# Altium schematic sheet Top.SchDoc
size 431 x 279 mm; Author: Shivam Sharma; SheetNumber: 1; SheetTotal: 4; SheetRevision: 1.0
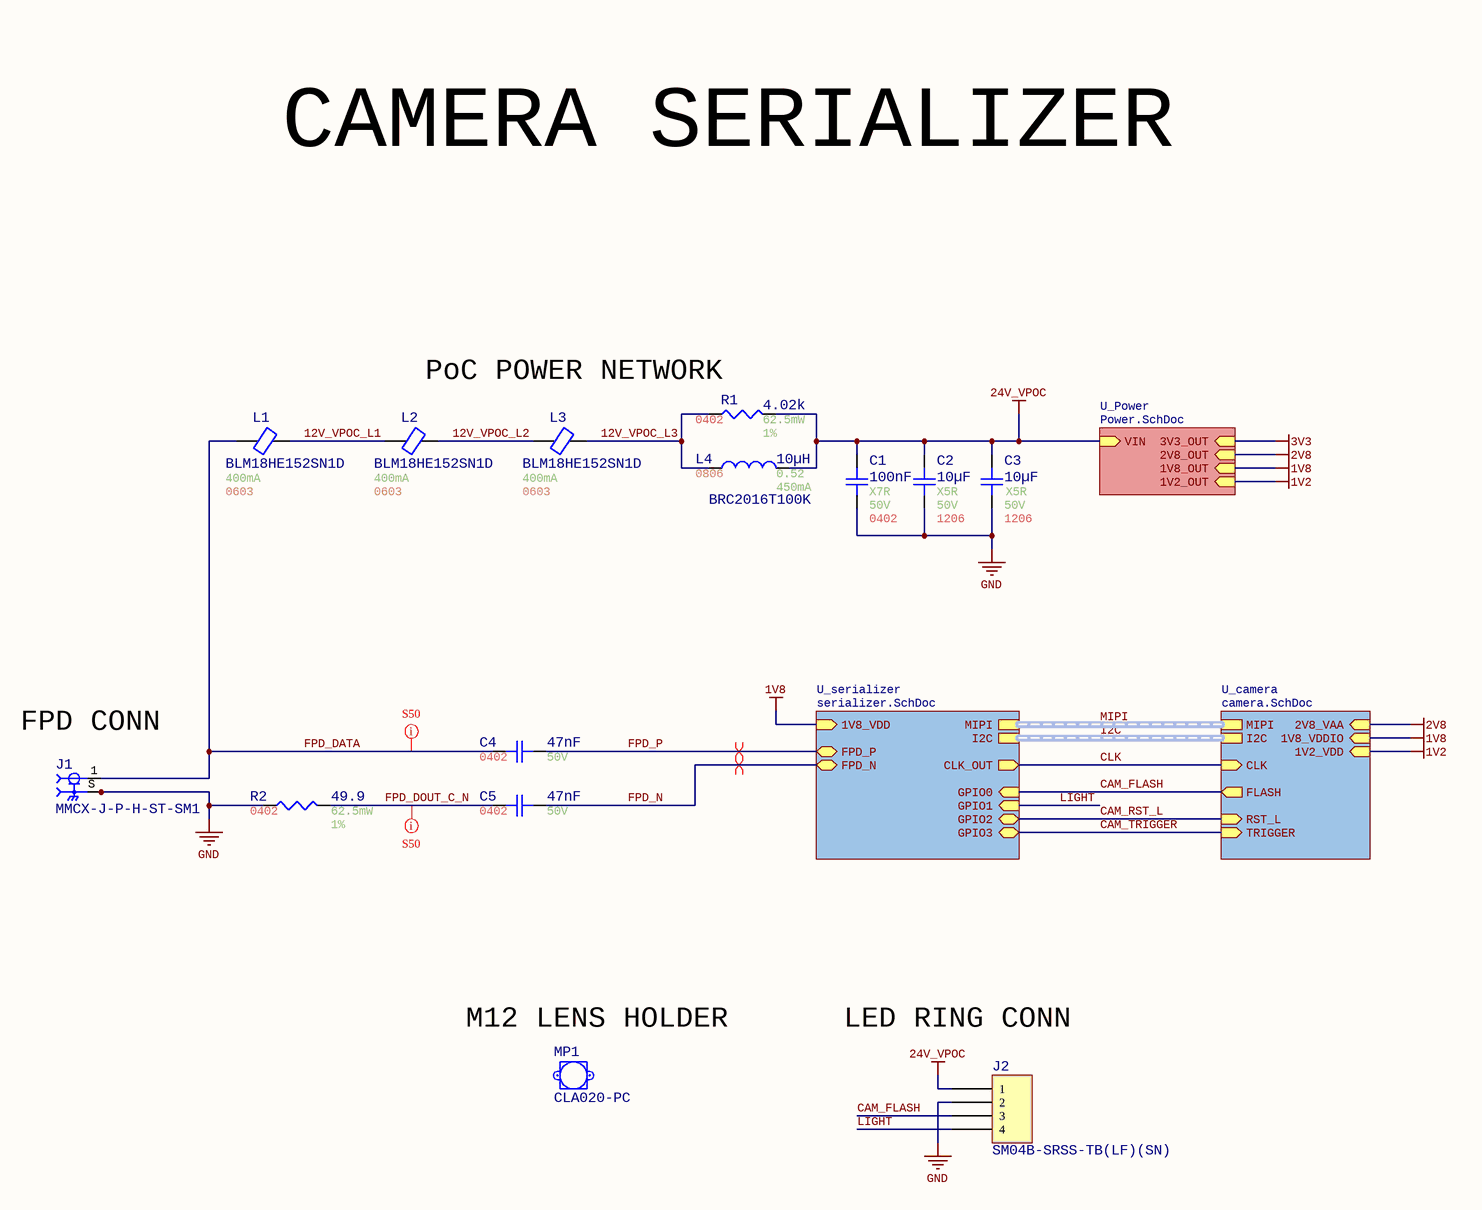
[diagram p0: Top.SchDoc]

## Parts
C1  value 100nF  Temperature Coefficient: X7R  Voltage Rating: 50V  Case/Package: 0402  [Generic 0402 capacitor]  (hidden comment: GRT155R71H104KE01D)
C2  value 10µF  Temperature Coefficient: X5R  Voltage Rating: 50V  Case/Package: 1206  [Generic 1206 Capacitor]  (hidden comment: CL31A106MBHNNNE)
C3  value 10µF  Temperature Coefficient: X5R  Voltage Rating: 50V  Case/Package: 1206  [Generic 1206 Capacitor]  (hidden comment: CL31A106MBHNNNE)
C4  value 47nF  Voltage Rating: 50V  Case/Package: 0402  [Generic 0402 capacitor]  (hidden comment: GRM155R71H473KE14D)
C5  value 47nF  Voltage Rating: 50V  Case/Package: 0402  [Generic 0402 capacitor]  (hidden comment: GRM155R71H473KE14D)
J1  MMCX-J-P-H-ST-SM1  [MMCX-J-P-H-ST-SM1]
J2  SM04B-SRSS-TB(LF)(SN)  [JST SM04B-SRSS-TB]
L1  BLM18HE152SN1D  Current Rating: 400mA  Case/Package: 0603  [0603_1.6x0.8x0.8mm_IND]
L2  BLM18HE152SN1D  Current Rating: 400mA  Case/Package: 0603  [0603_1.6x0.8x0.8mm_IND]
L3  BLM18HE152SN1D  Current Rating: 400mA  Case/Package: 0603  [0603_1.6x0.8x0.8mm_IND]
L4  BRC2016T100K  value 10µH  DCR: 0.52  Current Rating: 450mA  Case/Package: 0806  [0805_2.0x1.6x1.6mm_IND]
MP1  CLA020-PC  [M12_lens_holder_20mm]
R1  value 4.02k  Power: 62.5mW  Tolerance: 1%  Case/Package: 0402  [Generic 0402 Resistor]  (hidden comment: RCA04024K02FKEDSR)
R2  value 49.9  Power: 62.5mW  Tolerance: 1%  Case/Package: 0402  [Generic 0402 Resistor]  (hidden comment: RMCA0402FT49R9-HP)

## Sub-sheets
U_camera = camera.SchDoc: MIPI (harness MIPI), 2V8_VAA (in), 1V8_VDDIO (in), 1V2_VDD (in), I2C (harness I2C), TRIGGER (in), RST_L (in), CLK (in), FLASH (out)
U_Power = Power.SchDoc: VIN (in), 1V2_OUT (in), 3V3_OUT (in), 2V8_OUT (in), 1V8_OUT (in)
U_serializer = serializer.SchDoc: MIPI (harness MIPI), 1V8_VDD (in), FPD_P (bidir), FPD_N (bidir), I2C (harness I2C), GPIO3 (bidir), GPIO2 (bidir), GPIO1 (in), GPIO0 (in), CLK_OUT (out)

## Nets
1V2: sheet U_camera/1V2_VDD, sheet U_Power/1V2_OUT
1V8: sheet U_serializer/1V8_VDD, sheet U_camera/1V8_VDDIO, sheet U_Power/1V8_OUT
2V8: sheet U_camera/2V8_VAA, sheet U_Power/2V8_OUT
3V3: sheet U_Power/3V3_OUT
24V_VPOC: C1.2 C2.2 C3.2 J2.1 L4.2 R1.2 ; sheet U_Power/VIN
GND: C1.1 C2.1 C3.1 J1.S1 J1.S2 J1.S3 J1.S4 J2.2 R2.1
12V_VPOC_L1: L1.2 L2.1
12V_VPOC_L2: L2.2 L3.1
12V_VPOC_L3: L3.2 L4.1 R1.1
CAM_FLASH: J2.3 ; sheet U_serializer/GPIO0, sheet U_camera/FLASH
CAM_RST_L: sheet U_serializer/GPIO2, sheet U_camera/RST_L
CAM_TRIGGER: sheet U_serializer/GPIO3, sheet U_camera/TRIGGER
CLK: sheet U_serializer/CLK_OUT, sheet U_camera/CLK
FPD_DATA: C4.2 J1.1 L1.1
FPD_DOUT_C_N: C5.2 R2.2
FPD_N: C5.1 ; sheet U_serializer/FPD_N
FPD_P: C4.1 ; sheet U_serializer/FPD_P
LIGHT: J2.4 ; sheet U_serializer/GPIO1

## Buses and harness runs
harness I2C = sheet U_camera/I2C = sheet U_serializer/I2C
harness MIPI = sheet U_camera/MIPI = sheet U_serializer/MIPI

## Layout directives
net class S50: FPD_DATA, FPD_DOUT_C_N
differential pair: FPD_N, FPD_P

## Notes on the sheet
- CAMERA SERIALIZER
- PoC POWER NETWORK
- (near J1) FPD CONN
- (near MP1) M12 LENS HOLDER
- LED RING CONN
- Title:
- Author:
- Approved:
- Size:
- Date:
- Git Hash:
- Sch Revision:
- B
- Prj:
- Sheet Revision:
- Variant:
- Edited:
- CONFIDENTIAL
- File:
- (in symbol CMP-002-00135-2) S

## Library data of the parts
C1 = CMP-001-00084-12: Ceramic Capacitor, Multilayer, Ceramic, 50V, 10% +Tol, 10% -Tol, X7R, 15% TC, 0.1uF, Surface Mount, 0402; Multilayer: Yes; Terminal Finish: Nickel; Capacitor Type: Ceramic; Package Shape: Rectangular; Reach SVHC Compliant: Yes; Max Operating Temperature: 125°C; RoHS Compliant: Yes; Termination: Wraparound; Packaging: Tape and Reel; AECQ: Yes; Pins: 2; Dielectric Material: Ceramic; Min Operating Temperature: -55°C; Tolerance: 10%; Mounting Technology: Surface Mount
C2 C3 = CMP-001-00092-6: Ceramic Capacitor, Multilayer, Ceramic, 50V, 20% +Tol, 20% -Tol, X5R, 15% TC, 10uF, Surface Mount, 1206; AECQ: No; Multilayer: Yes; Reach SVHC Compliant: Yes; Package Shape: Rectangular; Temperature Characteristics Code: X5R; RoHS Compliant: Yes; Max Operating Temperature: 85°C; Mounting Technology: Surface Mount; Capacitor Type: Ceramic; Pins: 2; Packaging: Tape and Reel; Terminal Finish: Nickel; Tolerance: 20%; Termination: Wraparound; Dielectric Material: Ceramic; JESD-609 Code: e3; Min Operating Temperature: -55°C
C4 C5 = CMP-001-00113-1: 50V 47nF X7R ±10% 0402 Multilayer Ceramic Capacitors MLCC - SMD/SMT ROHS; AECQ: No; Mounting Technology: SMD; Tolerance: 10%; Pins: 2; Min Operating Temperature: -55°C; Max Operating Temperature: 125°C; Capacitor Type: Ceramic
J1 = CMP-002-00135-2: RF / Coaxial Connector, MMCX Coaxial, Straight Jack, Surface Mount Vertical, 50 ohm; Manufacturer: Samtec; Max Current Rating: 1.5A; Voltage Rating: 335V; Gender: Female; Connector Type: MMCX, Socket; Manufacturer Series: MMCX; Length: 3.45mm; Mounting Technology: Surface Mount; Pins: 2; Min Operating Temperature: -65°C; Case/Package: MMCX SMD; Max Operating Temperature: 125°C
J2 = SM04B-SRSS-TB(LF)(SN): CONN HEADER SMD R/A 4POS 1MM; Manufacturer: JST Sales America Inc.; Current Rating (Amps): 0.7A; Material Flammability Rating: UL94 V-0; Number of Positions: 4; Number of Positions Loaded: All; Pitch - Mating: 0.039" (1.00mm); Shrouding: Shrouded - 4 Wall; Style: Board to Cable/Wire; Voltage Rating: 50V; Part Number: SM04B-SRSS-TB(LF)(SN); ComponentLink1Description: Datasheet; ComponentLink1URL: http://www.jst-mfg.com/product/pdf/eng/eSH.pdf; ComponentLink2Description: DigiKey Link; ComponentLink2URL: http://digikey.com/product-detail/en/jst-sales-america-inc/SM04B-SRSS-TB-LF-SN/455-1804-1-ND/926875; Connector Type: Header; Contact Finish - Mating: Tin; Contact Finish - Post: Tin; Contact Material: Copper Alloy; Contact Shape: Square; Contact Type: Male Pin; Fastening Type: Push-Pull; Features: Solder Retention; Insulation Color: Natural; Insulation Height: 0.114" (2.90mm); Insulation Material: Polyamide (PA), Nylon; LastUpdated: 1/12/2020 11:41:52 PM; Lifecycle Status: Active; Minimum Order: 1; Mounting Type: Surface Mount, Right Angle; Number of Rows: 1; Operating Temperature: -25°C ~ 85°C; Packaging: TapeAndReel; PartId: 62; Part Status: Active; Price: 0.26; Series: SR; Supplier 1: DigiKey; Supplier Part Number 1: 455-1804-1-ND; Termination: Solder
L1-L3 = CMP-006-00026-1: Ferrite Beads Multi-Layer 1.5KOhm 25% 100MHz 500mA 500mOhm DCR 0603 T/R; Current - Saturation: 13.3A; AECQ: no; DCR: 20.5m; Shileded: Yes; Height: 800µm; Max Operating Temperature: 125°C; Pins: 2; Tolerance: 25%; Min Operating Temperature: -55°C
L4 = CMP-006-00025-2: IND 10UH 20% 3.1A SHD; Shileded: Yes; Tolerance: 10%; Self Resonant Frequency: 35MHz; Current - Saturation: 3.3A; AECQ: No; Pins: 2; Height: 1.6mm; Min Operating Temperature: -40°C; Max Operating Temperature: 105°C
MP1 = CMP-00015-2: M12 camera lens holder - 20mm spacing
R1 = CMP-009-00241-1: Fixed Resistor, Metal Glaze/Thick Film, 0.063W, 4020ohm, 50V, 1% +/-Tol, Surface Mount, 0402; Manufacturer Part Number: Blank; AECQ: Yes; Pins: 2; Voltage Rating: 50V; Max Operating Temperature: 155°C; Min Operating Temperature: -55°C; Mounting Technology: SMD
R2 = CMP-009-00240-1: RES, 0402, 49.9 ohm, 1%, 0.1W, AUTO; AECQ: Yes; Voltage Rating: 50V; Min Operating Temperature: -55°C; Mounting Technology: SMD; Manufacturer Part Number: RMCA0402FT49R9-HP; Max Operating Temperature: 155°C; Pins: 2